# EAGLE design McPiFace-7Segment-V1 (EAGLE 7.4.0)
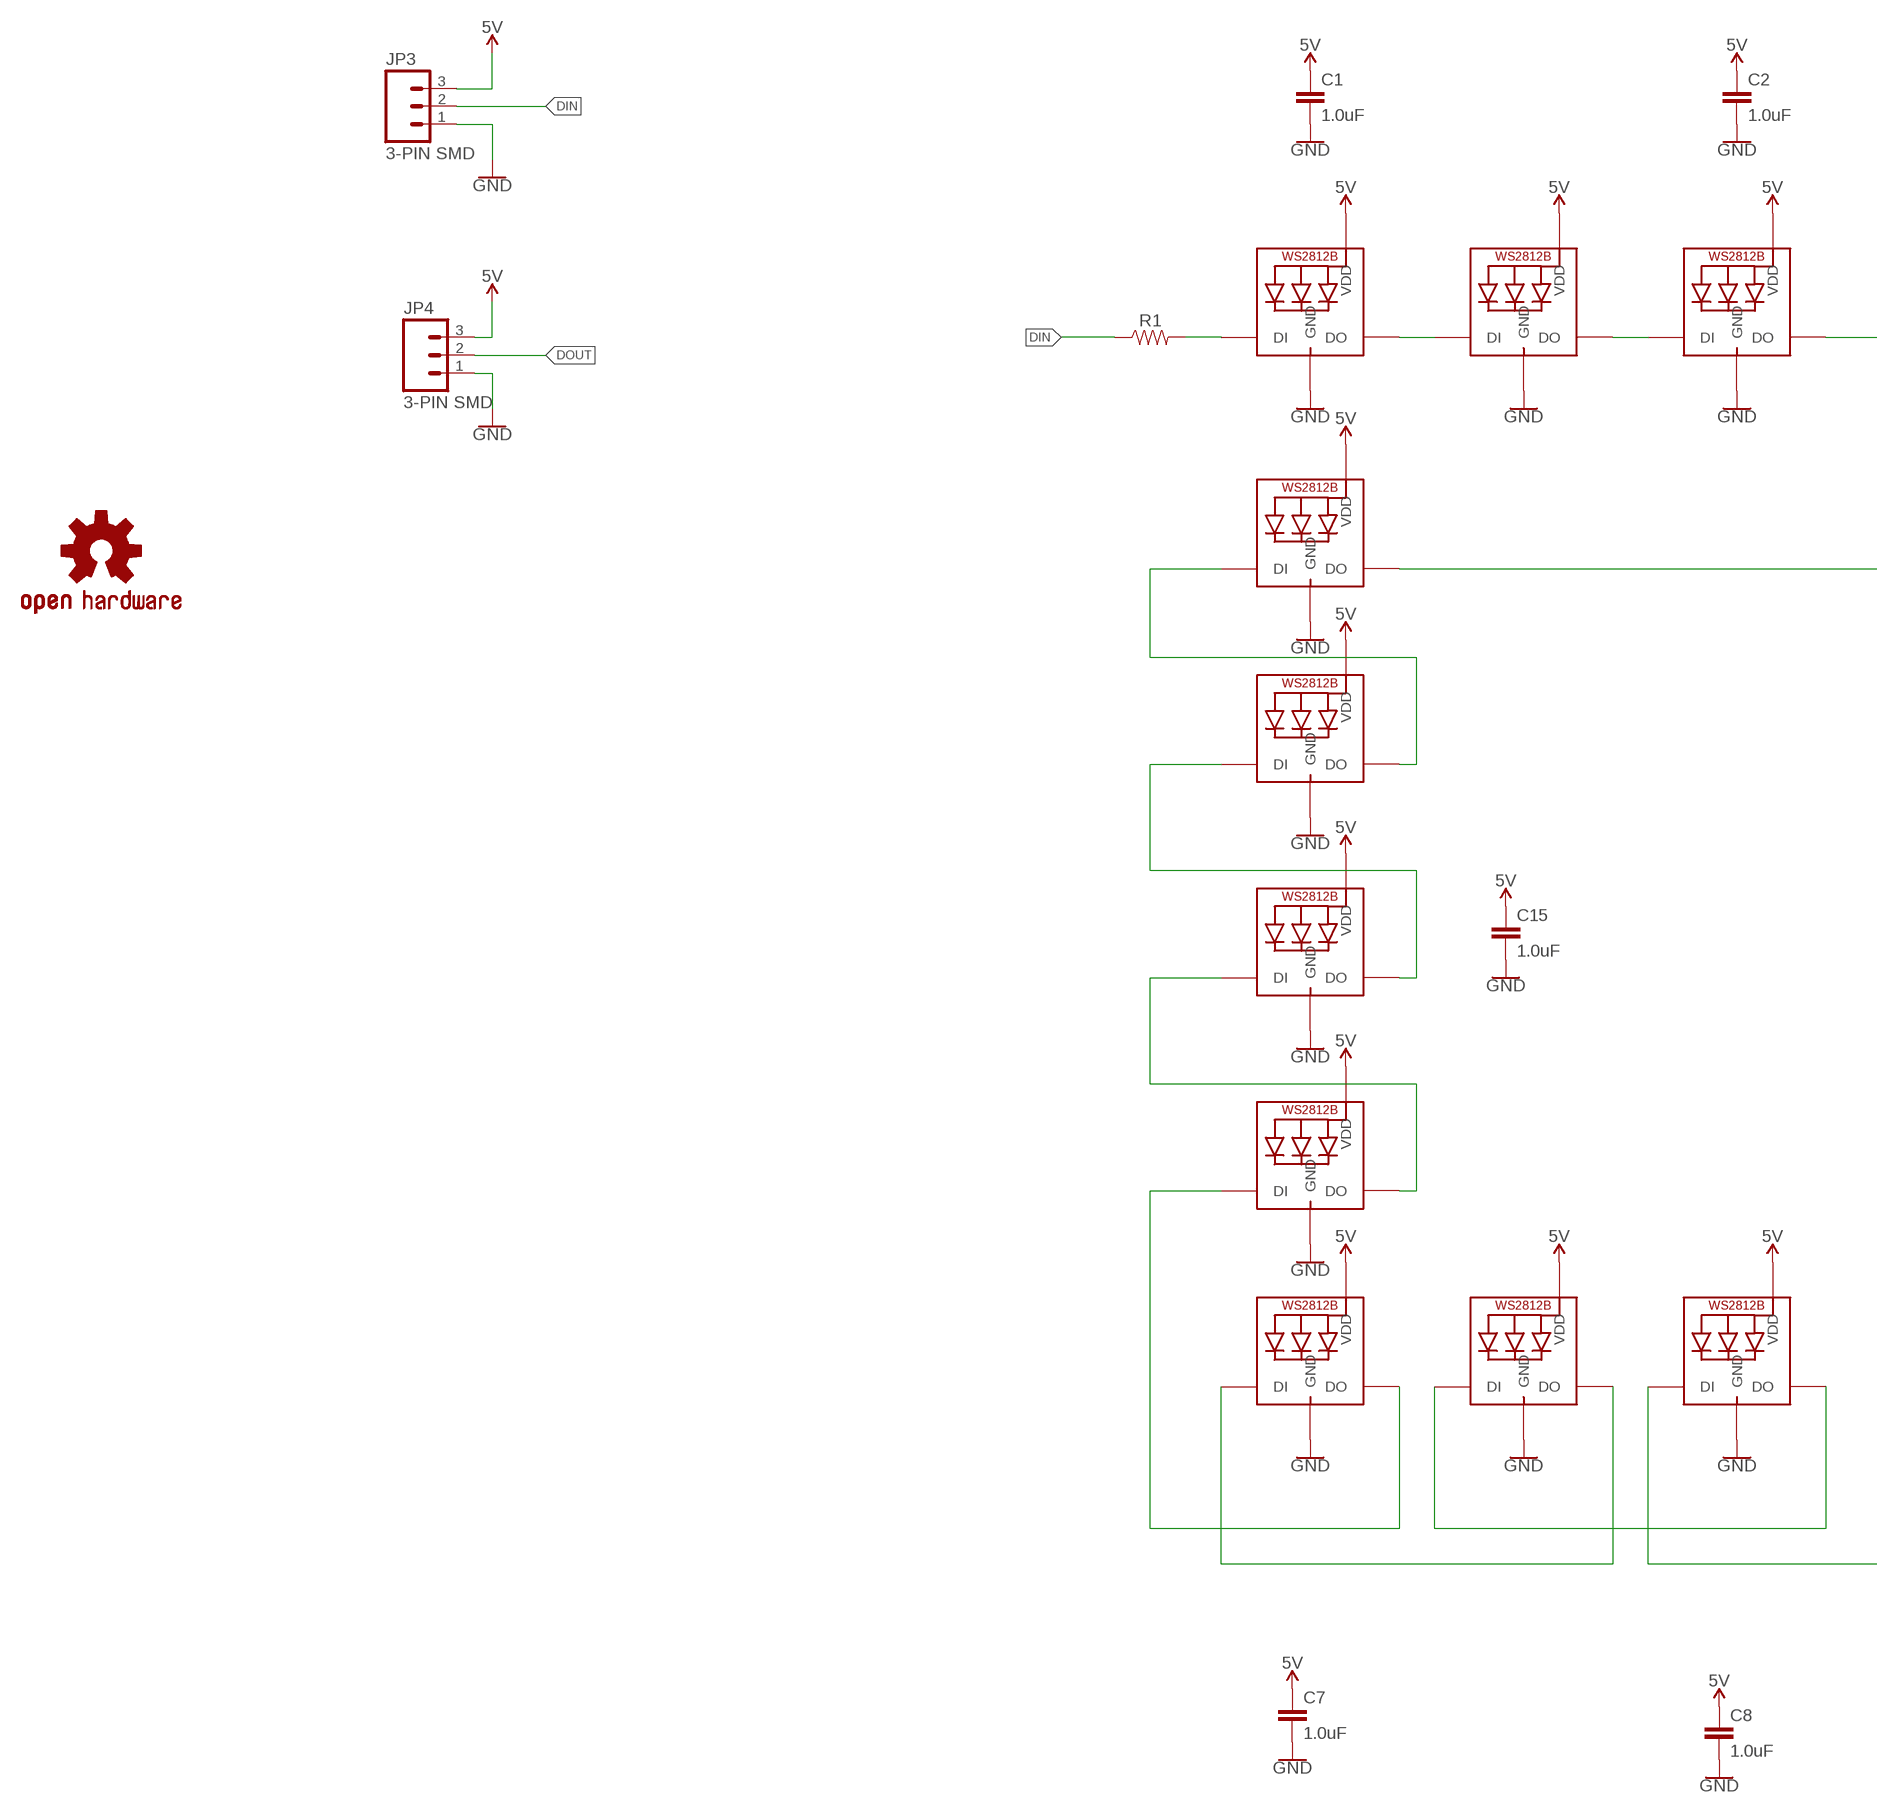
[diagram p0: schematic, sheet 1, part 1 of 2]
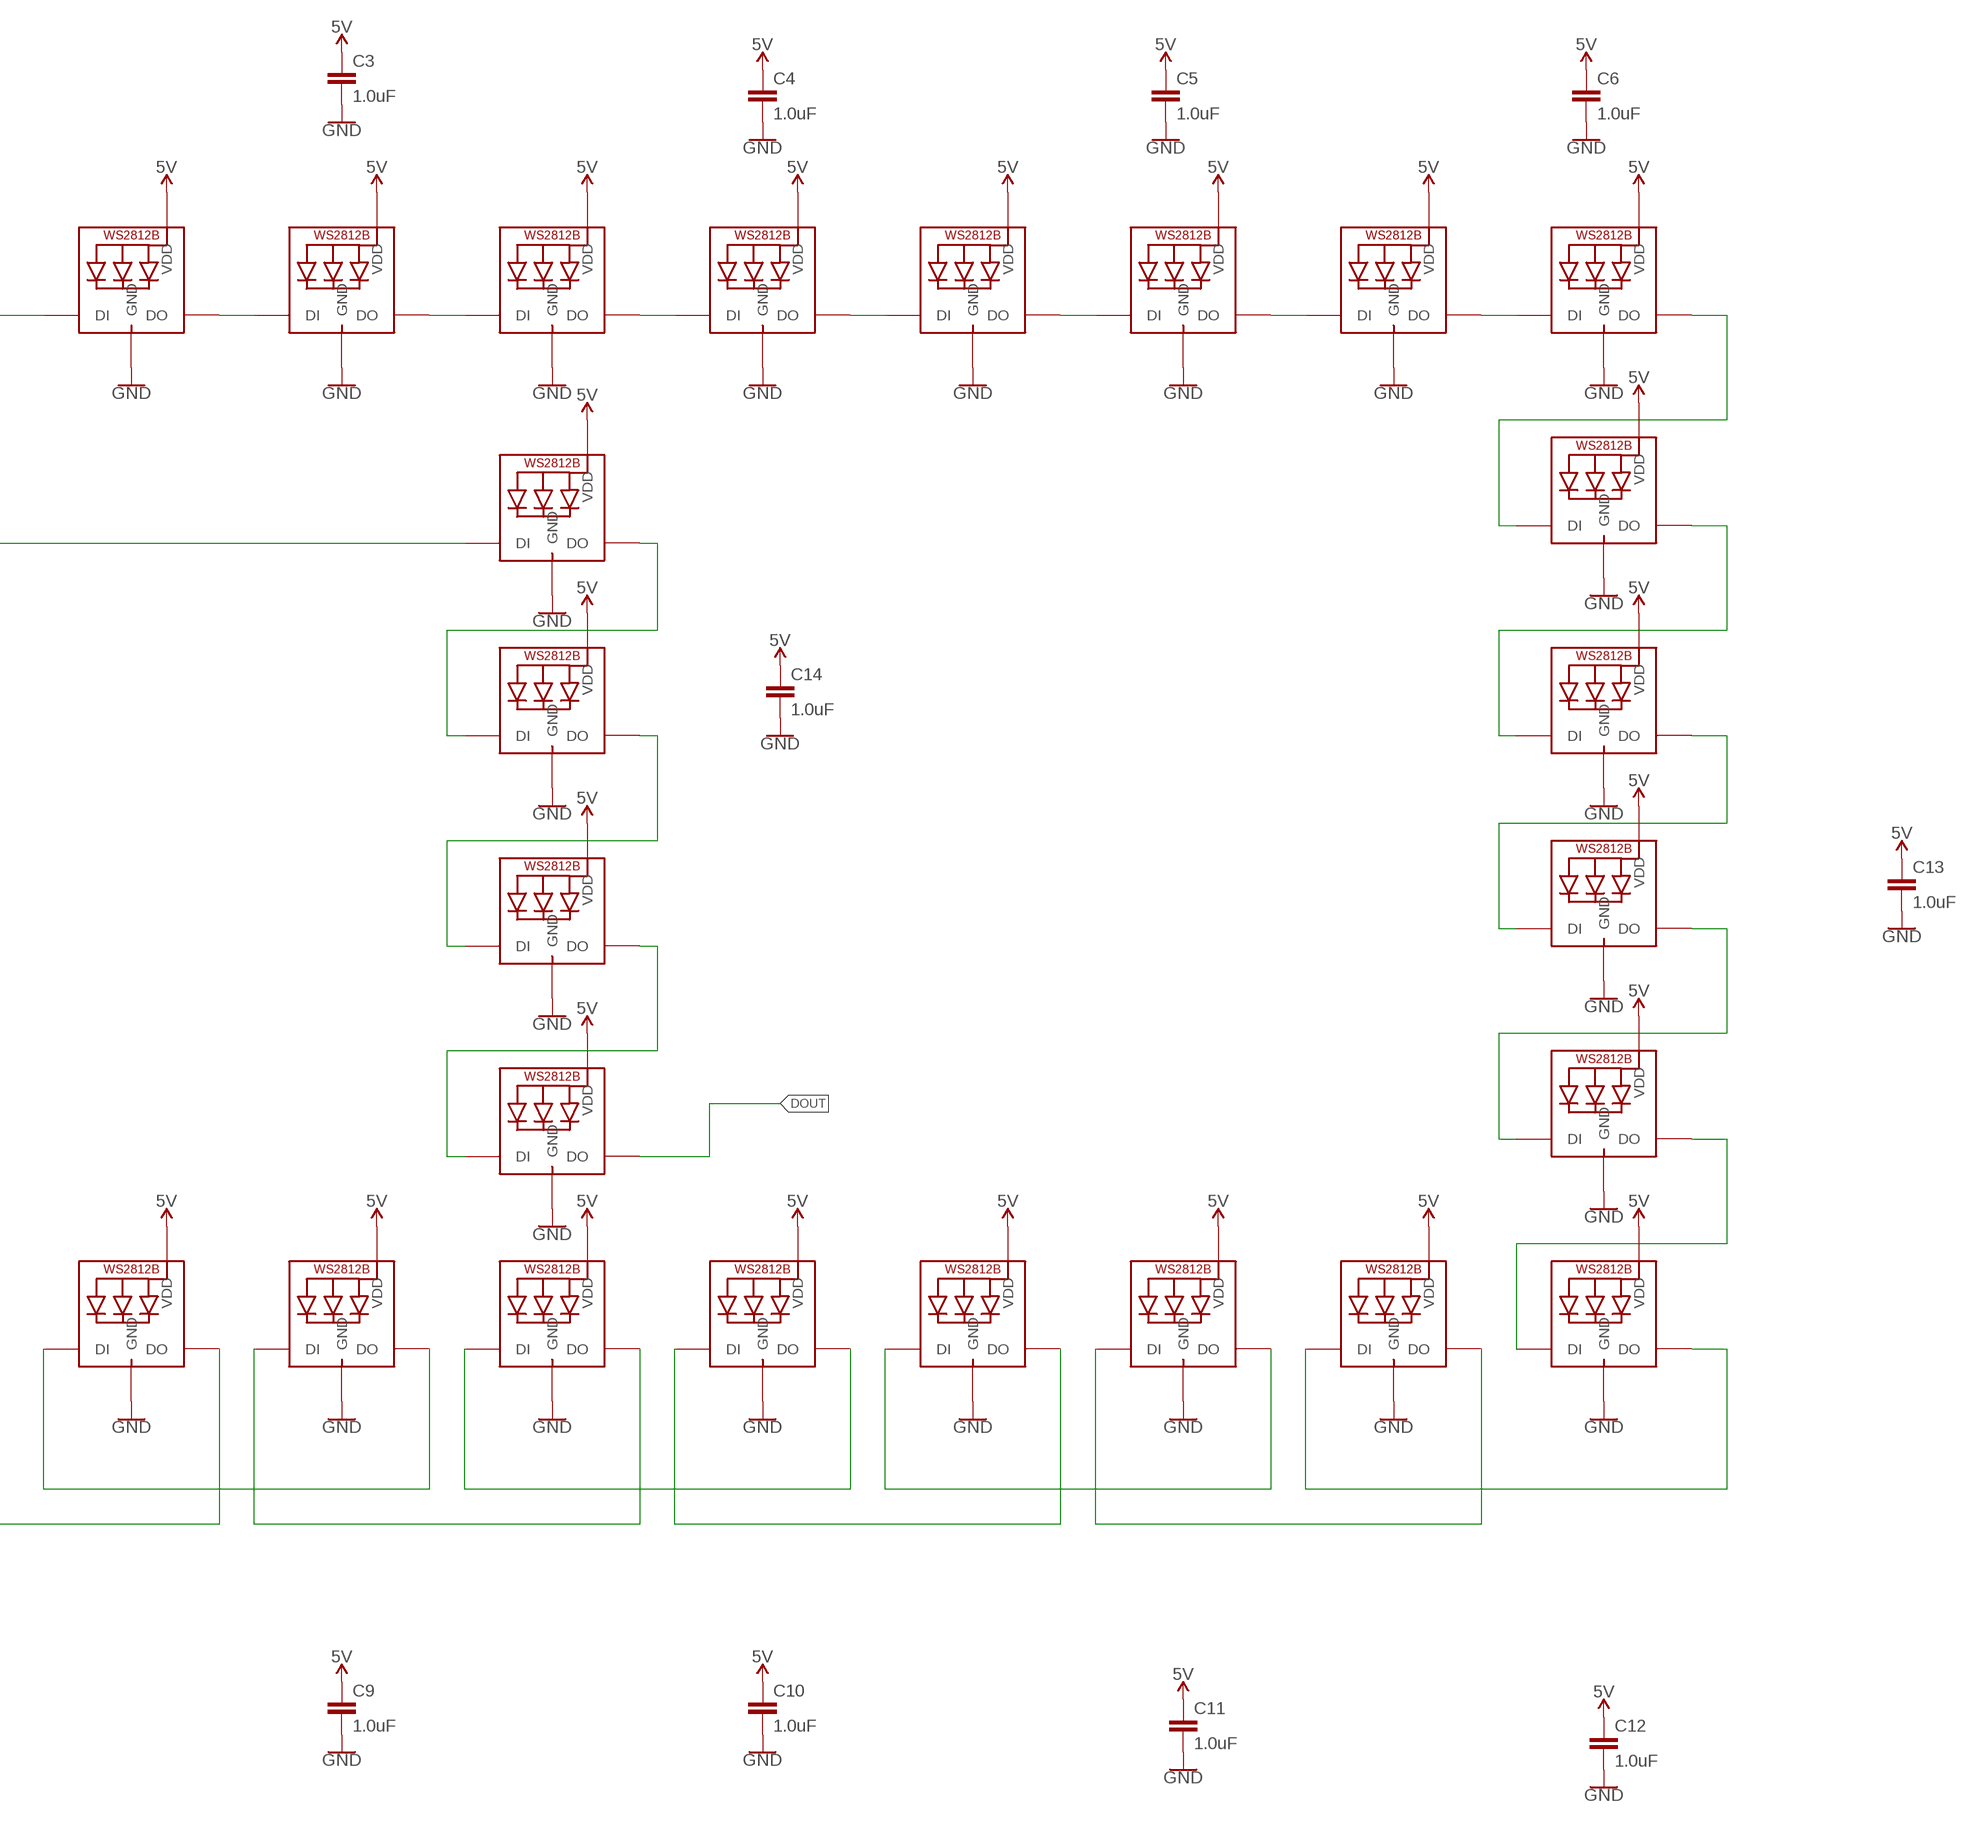
[diagram p1: schematic, sheet 1, part 2 of 2]

## Parts
C1  1.0uF  1.0UF-25V-+80/-20(0805)"  [0805-CAP]
C2  1.0uF  1.0UF-25V-+80/-20(0805)"  [0805-CAP]
C3  1.0uF  1.0UF-25V-+80/-20(0805)"  [0805-CAP]
C4  1.0uF  1.0UF-25V-+80/-20(0805)"  [0805-CAP]
C5  1.0uF  1.0UF-25V-+80/-20(0805)"  [0805-CAP]
C6  1.0uF  1.0UF-25V-+80/-20(0805)"  [0805-CAP]
C7  1.0uF  1.0UF-25V-+80/-20(0805)"  [0805-CAP]
C8  1.0uF  1.0UF-25V-+80/-20(0805)"  [0805-CAP]
C9  1.0uF  1.0UF-25V-+80/-20(0805)"  [0805-CAP]
C10  1.0uF  1.0UF-25V-+80/-20(0805)"  [0805-CAP]
C11  1.0uF  1.0UF-25V-+80/-20(0805)"  [0805-CAP]
C12  1.0uF  1.0UF-25V-+80/-20(0805)"  [0805-CAP]
C13  1.0uF  1.0UF-25V-+80/-20(0805)"  [0805-CAP]
C14  1.0uF  1.0UF-25V-+80/-20(0805)"  [0805-CAP]
C15  1.0uF  1.0UF-25V-+80/-20(0805)"  [0805-CAP]
JP3  3-PIN SMD  M03JST-SMD  [JST-3-SMD]
JP4  3-PIN SMD  M03JST-SMD  [JST-3-SMD]
LED1  WS2812B5050  [WS2812B]
LED2  WS2812B5050  [WS2812B]
LED3  WS2812B5050  [WS2812B]
LED4  WS2812B5050  [WS2812B]
LED5  WS2812B5050  [WS2812B]
LED6  WS2812B5050  [WS2812B]
LED7  WS2812B5050  [WS2812B]
LED8  WS2812B5050  [WS2812B]
LED9  WS2812B5050  [WS2812B]
LED10  WS2812B5050  [WS2812B]
LED11  WS2812B5050  [WS2812B]
LED12  WS2812B5050  [WS2812B]
LED13  WS2812B5050  [WS2812B]
LED14  WS2812B5050  [WS2812B]
LED15  WS2812B5050  [WS2812B]
LED16  WS2812B5050  [WS2812B]
LED17  WS2812B5050  [WS2812B]
LED18  WS2812B5050  [WS2812B]
LED19  WS2812B5050  [WS2812B]
LED20  WS2812B5050  [WS2812B]
LED21  WS2812B5050  [WS2812B]
LED22  WS2812B5050  [WS2812B]
LED23  WS2812B5050  [WS2812B]
LED24  WS2812B5050  [WS2812B]
LED25  WS2812B5050  [WS2812B]
LED26  WS2812B5050  [WS2812B]
LED27  WS2812B5050  [WS2812B]
LED28  WS2812B5050  [WS2812B]
LED29  WS2812B5050  [WS2812B]
LED30  WS2812B5050  [WS2812B]
LED31  WS2812B5050  [WS2812B]
LED32  WS2812B5050  [WS2812B]
LED33  WS2812B5050  [WS2812B]
LED34  WS2812B5050  [WS2812B]
LOGO1  OSHW-LOGOL  [OSHW-LOGO-L]
R1  RESISTOR0805  [0805]

## Nets
5V: C1.1 C2.1 C3.1 C4.1 C5.1 C6.1 C7.1 C8.1 C9.1 C10.1 C11.1 C12.1 C13.1 C14.1 C15.1 JP3.3 JP4.3 LED1.1-VDD(VDD) LED2.1-VDD(VDD) LED3.1-VDD(VDD) LED4.1-VDD(VDD) LED5.1-VDD(VDD) LED6.1-VDD(VDD) LED7.1-VDD(VDD) LED8.1-VDD(VDD) LED9.1-VDD(VDD) LED10.1-VDD(VDD) LED11.1-VDD(VDD) LED12.1-VDD(VDD) LED13.1-VDD(VDD) LED14.1-VDD(VDD) LED15.1-VDD(VDD) LED16.1-VDD(VDD) LED17.1-VDD(VDD) LED18.1-VDD(VDD) LED19.1-VDD(VDD) LED20.1-VDD(VDD) LED21.1-VDD(VDD) LED22.1-VDD(VDD) LED23.1-VDD(VDD) LED24.1-VDD(VDD) LED25.1-VDD(VDD) LED26.1-VDD(VDD) LED27.1-VDD(VDD) LED28.1-VDD(VDD) LED29.1-VDD(VDD) LED30.1-VDD(VDD) LED31.1-VDD(VDD) LED32.1-VDD(VDD) LED33.1-VDD(VDD) LED34.1-VDD(VDD)
DIN: JP3.2 R1.1
DOUT: JP4.2 LED15.2-DOUT(DO)
GND: C1.2 C2.2 C3.2 C4.2 C5.2 C6.2 C7.2 C8.2 C9.2 C10.2 C11.2 C12.2 C13.2 C14.2 C15.2 JP3.1 JP4.1 LED1.3-GND(GND) LED2.3-GND(GND) LED3.3-GND(GND) LED4.3-GND(GND) LED5.3-GND(GND) LED6.3-GND(GND) LED7.3-GND(GND) LED8.3-GND(GND) LED9.3-GND(GND) LED10.3-GND(GND) LED11.3-GND(GND) LED12.3-GND(GND) LED13.3-GND(GND) LED14.3-GND(GND) LED15.3-GND(GND) LED16.3-GND(GND) LED17.3-GND(GND) LED18.3-GND(GND) LED19.3-GND(GND) LED20.3-GND(GND) LED21.3-GND(GND) LED22.3-GND(GND) LED23.3-GND(GND) LED24.3-GND(GND) LED25.3-GND(GND) LED26.3-GND(GND) LED27.3-GND(GND) LED28.3-GND(GND) LED29.3-GND(GND) LED30.3-GND(GND) LED31.3-GND(GND) LED32.3-GND(GND) LED33.3-GND(GND) LED34.3-GND(GND)
N$1: LED1.2-DOUT(DO) LED2.4-DIN(DI)
N$5: LED1.4-DIN(DI) R1.2
N$8: LED2.2-DOUT(DO) LED3.4-DIN(DI)
N$9: LED3.2-DOUT(DO) LED4.4-DIN(DI)
N$11: LED4.2-DOUT(DO) LED5.4-DIN(DI)
N$12: LED5.2-DOUT(DO) LED6.4-DIN(DI)
N$13: LED6.2-DOUT(DO) LED7.4-DIN(DI)
N$14: LED7.2-DOUT(DO) LED8.4-DIN(DI)
N$15: LED8.2-DOUT(DO) LED9.4-DIN(DI)
N$16: LED9.2-DOUT(DO) LED10.4-DIN(DI)
N$17: LED10.2-DOUT(DO) LED11.4-DIN(DI)
N$18: LED11.2-DOUT(DO) LED17.4-DIN(DI)
N$19: LED17.2-DOUT(DO) LED18.4-DIN(DI)
N$20: LED18.2-DOUT(DO) LED19.4-DIN(DI)
N$21: LED19.2-DOUT(DO) LED20.4-DIN(DI)
N$22: LED20.2-DOUT(DO) LED21.4-DIN(DI)
N$23: LED21.2-DOUT(DO) LED22.4-DIN(DI)
N$24: LED22.2-DOUT(DO) LED23.4-DIN(DI)
N$25: LED23.2-DOUT(DO) LED24.4-DIN(DI)
N$26: LED24.2-DOUT(DO) LED25.4-DIN(DI)
N$27: LED16.4-DIN(DI) LED25.2-DOUT(DO)
N$28: LED16.2-DOUT(DO) LED26.4-DIN(DI)
N$29: LED26.2-DOUT(DO) LED27.4-DIN(DI)
N$30: LED27.2-DOUT(DO) LED28.4-DIN(DI)
N$31: LED28.2-DOUT(DO) LED29.4-DIN(DI)
N$32: LED29.2-DOUT(DO) LED30.4-DIN(DI)
N$33: LED30.2-DOUT(DO) LED31.4-DIN(DI)
N$34: LED31.2-DOUT(DO) LED32.4-DIN(DI)
N$35: LED32.2-DOUT(DO) LED33.4-DIN(DI)
N$36: LED33.2-DOUT(DO) LED34.4-DIN(DI)
N$37: LED12.4-DIN(DI) LED34.2-DOUT(DO)
N$38: LED12.2-DOUT(DO) LED13.4-DIN(DI)
N$39: LED13.2-DOUT(DO) LED14.4-DIN(DI)
N$40: LED14.2-DOUT(DO) LED15.4-DIN(DI)

## Library data of the parts
C1-C15 = SparkFun-Capacitors:1.0UF-25V-+80/-20(0805): CAP-11625; PROD_ID: CAP-11625
JP3 JP4 = SparkFun-Connectors:M03: Header 3 Standard 3-pin 0.1" header. Use with straight break away headers (SKU : PRT-00116), right angle break away headers (PRT-00553), swiss pins (PRT-00743), machine pins (PRT-00117), and female headers (PRT-00115). Molex polarized connector foot print use with SKU : PRT-08232 with associated crimp pins and housings.; PROD_ID: CONN-12591
LED1-LED34 = ThingySticks:WS2812B
LOGO1 = SparkFun-Aesthetics:OSHW-LOGO: Open-Source Hardware (OSHW) Logo This logo indicates the piece of hardware it is found on incorporates a OSHW license and/or adheres to the definition of open source hardware found here: http://freedomdefined.org/OSHW
R1 = SparkFun-Resistors:RESISTOR: Generic Resistor Package

## Board
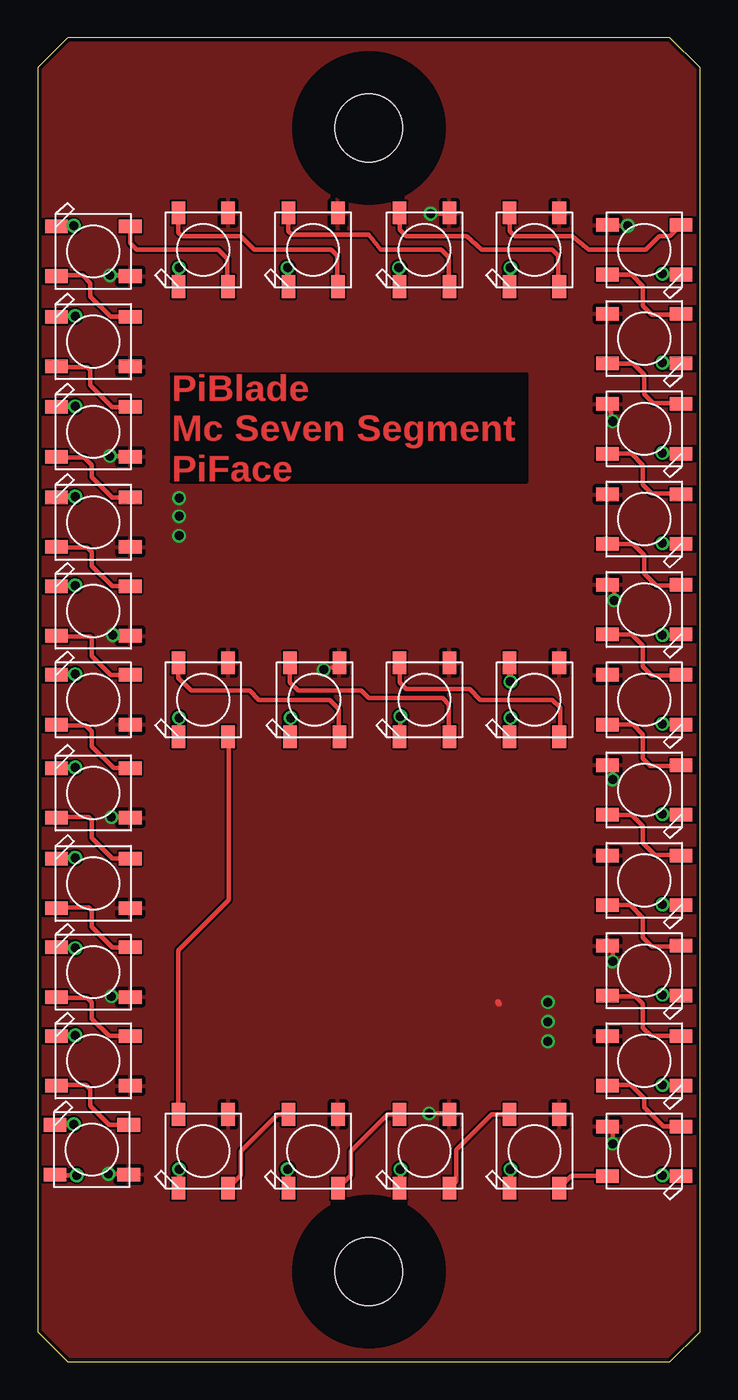
[diagram p2: board, top side]
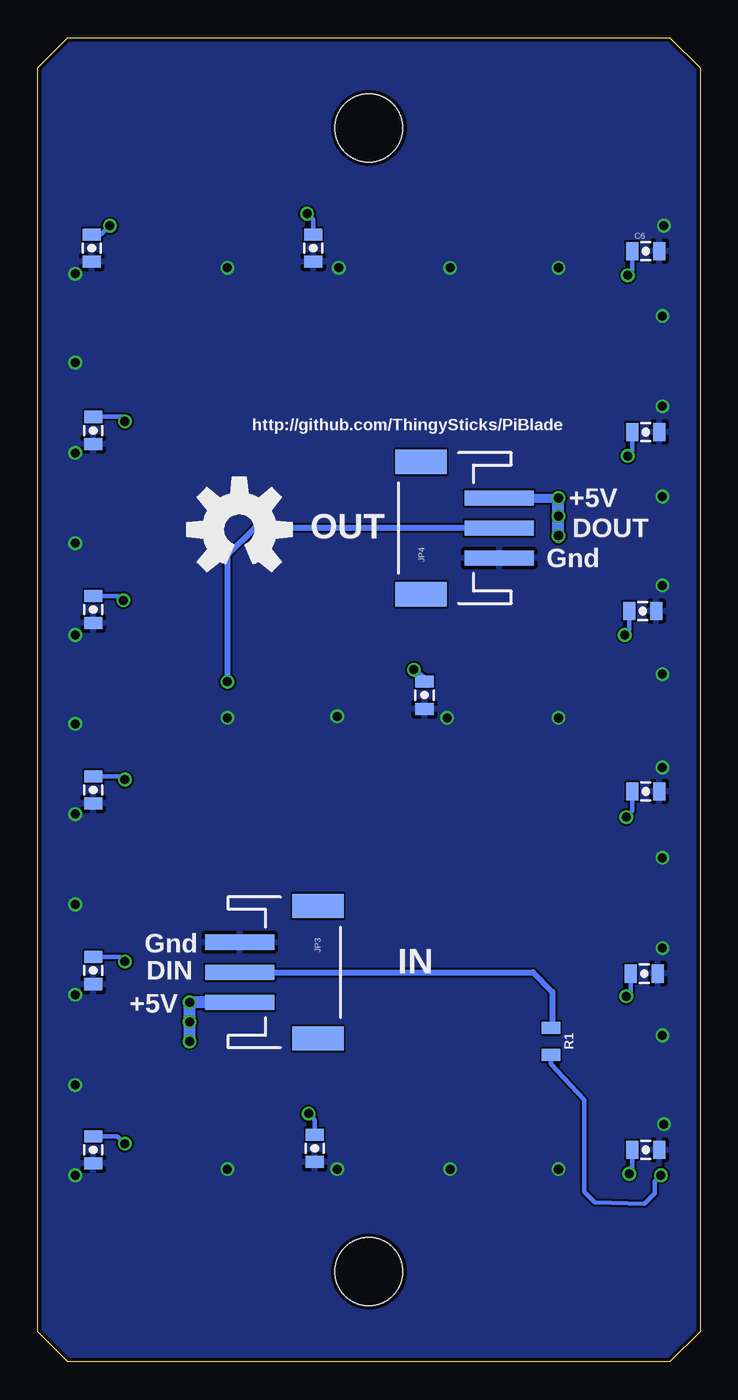
[diagram p3: board, bottom side, seen from below]

Size 44 x 88 mm. Coordinates in mm from the lower left corner, seen from the top.
Outline: 2,0 42,0 44,2 44,86 42,88 2,88 0,86 0,2 2,0
Copper layers (1*16): Top 0.035mm / dielectric 1.5mm / Bottom 0.035mm
Design rules "dirt_cheap_dirty_boards.v1": minimum track width 5mil, minimum drill 12mil, track to track 5mil, track to pad 5mil, pad to pad 5mil, via to via 5mil, smd to smd 0mil, copper to edge 10mil, drill to drill 10mil, minimum pad ring 10mil, minimum via ring 6mil, stop-mask expansion 2mil, vias tented up to drill 25mil, thermal gap 10mil
Holes 4.5 mm at 22,6 22,82
tRestrict: area 17,77 to 27,87; area 17,1 to 27,11

### Footprints (pad centres in the part's own frame; a part is rotated, then mirrored left to right if it is on the bottom)
0805-CAP = smd 0.8 x 1.2: 1 -0.9,0; 2 0.9,0
JST-3-SMD = smd 1 x 4.6: 1 -1.99,-4.77; 2 0.01,-4.77; 3 2.01,-4.77 | smd 1.6 x 3.4: NC1 -4.39,0.43; NC2 4.41,0.43
WS2812B = smd 1.5 x 0.9: 1-VDD 2.45,-1.65; 2-DOUT 2.45,1.65; 3-GND -2.45,1.65; 4-DIN -2.45,-1.65
0805 = smd 0.8 x 1.2: 1 -0.9,0; 2 0.9,0

### Placement (x,y rotation side)
C1  3.6,14.1 0 bottom
C2  3.7,25.8 0 bottom
C3  3.6,37.9 0 bottom
C4  3.8,49.9 0 bottom
C5  3.6,61.8 0 bottom
C6  3.6,73.8 0 bottom
C7  25.7,74 270 bottom
C8  40.4,74 270 bottom
C9  40.3,61.9 270 bottom
C10  40.3,50 270 bottom
C11  40.3,38 270 bottom
C12  40.3,26 270 bottom
C13  40.3,14.1 270 bottom
C14  18.3,44.3 270 bottom
C15  25.6,14.2 270 bottom
JP3  25.8,25.9 270 bottom
JP4  18.1,55.4 90 bottom
LED1  3.6,14.1 0 top
LED2  3.7,20 0 top
LED3  3.7,25.9 0 top
LED4  3.7,31.8 0 top
LED5  3.7,37.8 0 top
LED6  3.7,44 0 top
LED7  3.7,49.9 0 top
LED8  3.7,55.8 0 top
LED9  3.7,61.8 0 top
LED10  3.7,67.8 0 top
LED11  3.7,73.8 0 top
LED12  11,44 90 top
LED13  18.4,44 90 top
LED14  25.7,44 90 top
LED15  33,44 90 top
LED16  40.3,44 180 top
LED17  11,73.9 90 top
LED18  18.3,73.9 90 top
LED19  25.7,73.9 90 top
LED20  33,73.9 90 top
LED21  40.3,73.9 180 top
LED22  40.3,68 180 top
LED23  40.3,62 180 top
LED24  40.3,56 180 top
LED25  40.3,50 180 top
LED26  40.3,38 180 top
LED27  40.3,32 180 top
LED28  40.3,26 180 top
LED29  40.3,20 180 top
LED30  40.3,14 180 top
LED31  33,14 90 top
LED32  25.7,14 90 top
LED33  18.3,14 90 top
LED34  11,14 90 top
LOGO1  30.6,55.3 0 bottom
R1  9.9,21.3 270 bottom

### Tracks (layer width: path | path; a pad name or v marks a point on that pad's centre or on a via)
5V  (via drill 0.6)
  Top 0.305: v4.8,72.2 6.1,72.2 LED11.1-VDD | v4.8,60.2 6.1,60.2 LED9.1-VDD | v5,48.3 6.1,48.3 LED7.1-VDD | v4.9,36.2 6.1,36.2 LED5.1-VDD | v4.9,24.3 6.1,24.3 LED3.1-VDD | v4.7,12.5 6,12.5 LED1.1-VDD | v19,46 19.8,46.2 LED13.1-VDD | v26.1,76.3 27.3,76.3 LED19.1-VDD | v39.2,75.5 37.9,75.5 LED21.1-VDD | v38.2,62.5 38,63.5 LED23.1-VDD | v38.3,50.6 38.3,51.2 LED25.1-VDD | v38.2,38.7 38.2,39.3 LED26.1-VDD | v38.2,26.6 38.2,27.3 LED28.1-VDD | v38.2,14.5 38.2,15.3 LED30.1-VDD | v26,16.5 27.3,16.5 LED32.1-VDD
  Top 0.406: 33.9,23.7 34,23.8 | 30.66,23.8 JP3.3
  Bottom 0.305: C6.1 4.5,72.5 v4.8,72.2 | C5.1 4.5,60.5 v4.8,60.2 | C4.1 4.7,48.6 v5,48.3 | C3.1 4.5,36.6 v4.9,36.2 | C2.1 4.6,24.6 v4.9,24.3 | C1.1 4.5,12.7 v4.7,12.5 | C14.1 18.3,45.5 v19,46 | C7.1 25.7,75.9 v26.1,76.3 | C8.1 39.8,74.9 v39.2,75.5 | C9.1 38.3,62.8 v38.2,62.5 | C10.1 38.6,50.9 v38.3,50.6 | C11.1 38.4,38.9 v38.2,38.7 | C12.1 38.5,26.9 v38.2,26.6 | C13.1 38.7,15 v38.2,14.5 | C15.1 25.6,16.1 v26,16.5
  Bottom 0.61: JP4.3 v9.41,57.41 v9.4,57.4
  Bottom 0.813: JP3.3 v33.89,23.89 v33.9,23.9 v33.9,21.3 | 9.4,54.8 v9.4,57.4
  other vias: 33.9,22.6 9.4,56.2 9.4,54.9
  pour Top: -1,88.5 45,88.5 45,-1 -1,-1
DIN
  Bottom 0.406: JP3.2 11.09,25.89 9.8,24.6 9.8,22.3 R1.1
DOUT  (via drill 0.6)
  Top 0.406: v31.4,45.2 31.4,46.4 LED15.2-DOUT
  Bottom 0.406: JP4.2 29.59,55.41 31.4,53.6 v31.4,45.2
GND  (via drill 0.6)
  Top 0.305: v16.8,42.8 16.8,41.6 LED13.3-GND | v9.4,42.8 9.4,41.6 LED12.3-GND | v24.1,42.9 24.1,41.6 LED14.3-GND | v31.4,42.8 31.4,41.6 LED15.3-GND | v41.5,72.3 42.7,72.3 LED21.3-GND | v41.5,60.4 42.7,60.4 LED23.3-GND | v41.5,54.4 42.7,54.4 LED24.3-GND | v41.5,48.3 42.7,48.3 LED25.3-GND | v41.5,42.4 42.7,42.4 LED16.3-GND | v41.5,36.4 42.7,36.4 LED26.3-GND | v41.5,30.4 42.7,30.4 LED27.3-GND | v41.5,24.4 42.7,24.4 LED28.3-GND | v41.5,18.4 42.7,18.4 LED29.3-GND | v41.5,12.4 42.7,12.4 LED30.3-GND | v41.5,66.4 42.7,66.4 LED22.3-GND
  Top 0.406: v2.4,15.8 1.2,15.8 LED1.3-GND | v2.5,21.7 1.4,21.7 LED2.3-GND | v2.5,27.5 1.5,27.5 LED3.3-GND | v2.5,33.5 1.5,33.5 LED4.3-GND | v2.5,39.5 1.4,39.5 LED5.3-GND | v2.5,45.7 1.5,45.7 LED6.3-GND | v2.5,51.6 1.4,51.6 LED7.3-GND | v2.5,57.5 1.5,57.5 LED8.3-GND | v2.5,63.5 1.5,63.5 LED9.3-GND | v2.5,69.5 1.4,69.5 LED10.3-GND | v2.4,75.5 1.3,75.5 LED11.3-GND | LED17.3-GND 9.35,72.65 v9.4,72.7 | v16.6,72.7 16.6,71.5 LED18.3-GND | v24,72.7 24,71.5 LED19.3-GND | v31.4,72.7 31.4,71.5 LED20.3-GND | v31.4,12.8 31.4,11.6 LED31.3-GND | v24.1,12.8 24.1,11.6 LED32.3-GND | v16.6,12.8 16.6,11.6 LED33.3-GND | v9.4,12.8 9.4,11.6 LED34.3-GND
  pour Bottom: -1,88.5 45,88.5 45,-1 -1,-1
N$1
  Top 0.305: LED1.2-DOUT 4.75,15.75 3.5,17 3.5,18.1 3.2,18.4 1.3,18.4 LED2.4-DIN
N$5  (via drill 0.6)
  Top 0.305: v2.6,12.4 1.2,12.4 LED1.4-DIN
  Bottom 0.305: R1.2 9.9,19.8 7.7,17.4 7.7,11.3 7,10.6 3.7,10.5 3,11.2 3,12 v2.6,12.4
N$8
  Top 0.305: LED2.2-DOUT 4.75,21.65 3.6,22.8 3.6,23.9 3.3,24.2 1.3,24.2 LED3.4-DIN
N$9
  Top 0.305: LED3.2-DOUT 4.95,27.55 3.6,28.9 3.6,30 3.4,30.2 1.3,30.2 LED4.4-DIN
N$11
  Top 0.305: LED4.2-DOUT 4.95,33.45 3.6,34.8 3.6,36 3.4,36.2 1.3,36.2 LED5.4-DIN
N$12
  Top 0.305: LED5.2-DOUT 5.05,39.45 3.6,40.9 3.6,41.9 3.2,42.3 1.3,42.3 LED6.4-DIN
N$13
  Top 0.305: LED6.2-DOUT 4.85,45.65 3.6,46.9 3.6,48.1 3.5,48.2 1.3,48.2 LED7.4-DIN
N$14
  Top 0.305: LED7.2-DOUT 4.95,51.55 3.6,52.9 3.6,53.8 3.3,54.1 1.3,54.1 LED8.4-DIN
N$15
  Top 0.305: LED8.2-DOUT 4.95,57.45 3.6,58.8 3.6,59.6 3.1,60.1 1.3,60.1 LED9.4-DIN
N$16
  Top 0.305: LED9.2-DOUT 4.95,63.45 3.5,64.9 3.5,65.9 3.3,66.1 1.3,66.1 LED10.4-DIN
N$17
  Top 0.305: LED10.2-DOUT 4.85,69.45 3.5,70.8 3.5,71.7 3,72.2 1.3,72.2 LED11.4-DIN
N$18
  Top 0.305: LED11.2-DOUT 6.15,74.35 6.6,73.9 12,73.9 12.6,73.3 12.6,71.5 LED17.4-DIN
N$19
  Top 0.305: LED17.2-DOUT 9.35,75.05 9.6,74.8 13.5,74.8 14.4,73.9 19.5,73.9 19.9,73.5 19.9,71.5 LED18.4-DIN
N$20
  Top 0.305: LED18.2-DOUT 16.65,75.15 16.9,74.9 22,74.9 22.8,73.9 26.8,73.9 27.3,73.4 27.3,71.5 LED19.4-DIN
N$21
  Top 0.305: LED19.2-DOUT 24.05,75.25 24.5,74.8 28.5,74.8 29.5,73.9 34.2,73.9 34.6,73.5 34.6,71.5 LED20.4-DIN
N$22
  Top 0.305: LED20.2-DOUT 31.35,75.15 31.7,74.8 35.5,74.8 36.6,73.9 40.4,73.9 41.3,74.8 42,74.8 LED21.4-DIN
N$23
  Top 0.305: LED21.2-DOUT 39.45,72.25 40.2,71.5 40.2,70.2 40.8,69.6 42.7,69.6 LED22.4-DIN
N$24
  Top 0.305: LED22.2-DOUT 39.55,66.35 40.3,65.6 40.3,64.3 40.9,63.7 42.7,63.7 LED23.4-DIN
N$25
  Top 0.305: LED23.2-DOUT 39.45,60.35 40.2,59.6 40.2,58.3 40.8,57.7 42.7,57.7 LED24.4-DIN
N$26
  Top 0.305: LED24.2-DOUT 39.55,54.35 40.3,53.6 40.3,52.4 41.1,51.6 42.7,51.6 LED25.4-DIN
N$27
  Top 0.305: LED25.2-DOUT 39.45,48.35 40.2,47.6 40.2,46.2 40.8,45.6 42.7,45.6 LED16.4-DIN
N$28
  Top 0.305: LED16.2-DOUT 39.55,42.35 40.2,41.7 40.2,40.1 40.7,39.6 42.7,39.6 LED26.4-DIN
N$29
  Top 0.305: LED26.2-DOUT 39.45,36.35 40.2,35.6 40.2,34.5 41,33.7 42.7,33.7 LED27.4-DIN
N$30
  Top 0.305: LED27.2-DOUT 39.35,30.35 40.2,29.5 40.2,28.2 40.8,27.6 42.7,27.6 LED28.4-DIN
N$31
  Top 0.305: LED29.4-DIN 40.75,21.65 40.2,22.2 40.2,23.8 39.7,24.3 37.9,24.3 LED28.2-DOUT
N$32
  Top 0.305: LED30.4-DIN 41.55,15.65 40.3,16.9 40.3,17.5 39.4,18.4 37.9,18.4 LED29.2-DOUT
N$33
  Top 0.305: LED30.2-DOUT 35.45,12.35 LED31.4-DIN
N$34
  Top 0.305: LED31.2-DOUT 30.15,16.45 27.8,14.1 27.8,12 LED32.4-DIN
N$35
  Top 0.305: LED32.2-DOUT 23.25,16.45 20.8,14 20.8,12.4 LED33.4-DIN
N$36
  Top 0.305: LED33.2-DOUT 15.95,16.45 13.5,14 13.5,12.4 LED34.4-DIN
N$37
  Top 0.305: LED34.2-DOUT 9.35,27.35 12.7,30.7 12.7,41.5 LED12.4-DIN
N$38
  Top 0.305: LED12.2-DOUT 9.35,45.45 10.2,44.6 14.1,44.6 14.7,44 19.4,44 20,43.4 20,41.6 LED13.4-DIN
N$39
  Top 0.305: LED13.2-DOUT 16.75,45.15 17.3,44.6 21.5,44.6 22,44.1 26.9,44.1 27.3,43.7 27.3,41.6 LED14.4-DIN
N$40
  Top 0.305: LED14.2-DOUT 24.05,45.15 24.5,44.7 28.7,44.7 29.4,44 34.2,44 34.7,43.5 34.7,41.6 LED15.4-DIN

### Text on the board
Top: PiBlade / Mc Seven Segment / PiFace
bNames: http://github.com/ThingySticks/PiBlade | +5V | DOUT | OUT | Gnd | Gnd | IN | DIN | +5V